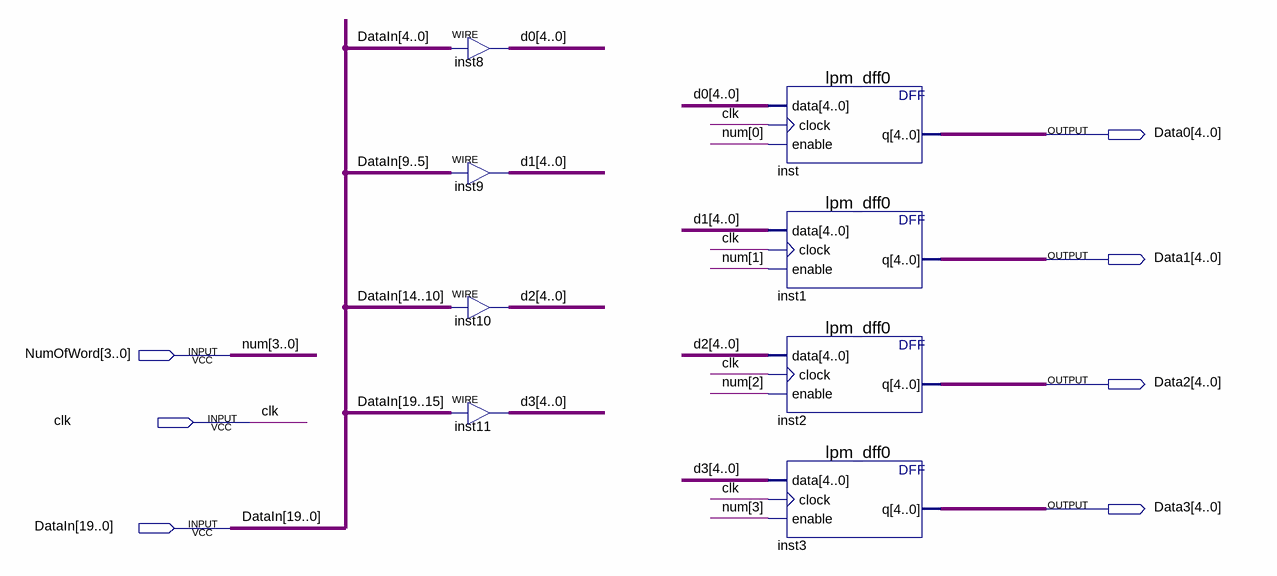
[diagram p0: schematic sheet]
// Quartus schematic String.bdf as structural Verilog: 8 symbols, 7 pins
module String (
  input  [3:0] NumOfWord,
  input  clk,
  input  [19:0] DataIn,
  output [4:0] Data0,
  output [4:0] Data1,
  output [4:0] Data2,
  output [4:0] Data3
);

  wire [4:0] d0, d1, d2, d3;

  assign d0 = DataIn[4:0];  // WIRE inst8
  assign d1 = DataIn[9:5];  // WIRE inst9
  assign d2 = DataIn[14:10];  // WIRE inst10
  assign d3 = DataIn[19:15];  // WIRE inst11
  lpm_dff0 inst (.data(d0), .clock(clk), .enable(NumOfWord[0]), .q(Data0));
  lpm_dff0 inst1 (.data(d1), .clock(clk), .enable(NumOfWord[1]), .q(Data1));
  lpm_dff0 inst2 (.data(d2), .clock(clk), .enable(NumOfWord[2]), .q(Data2));
  lpm_dff0 inst3 (.data(d3), .clock(clk), .enable(NumOfWord[3]), .q(Data3));

  // Other names for the same wires on the sheet: num[3:0] = NumOfWord
endmodule
